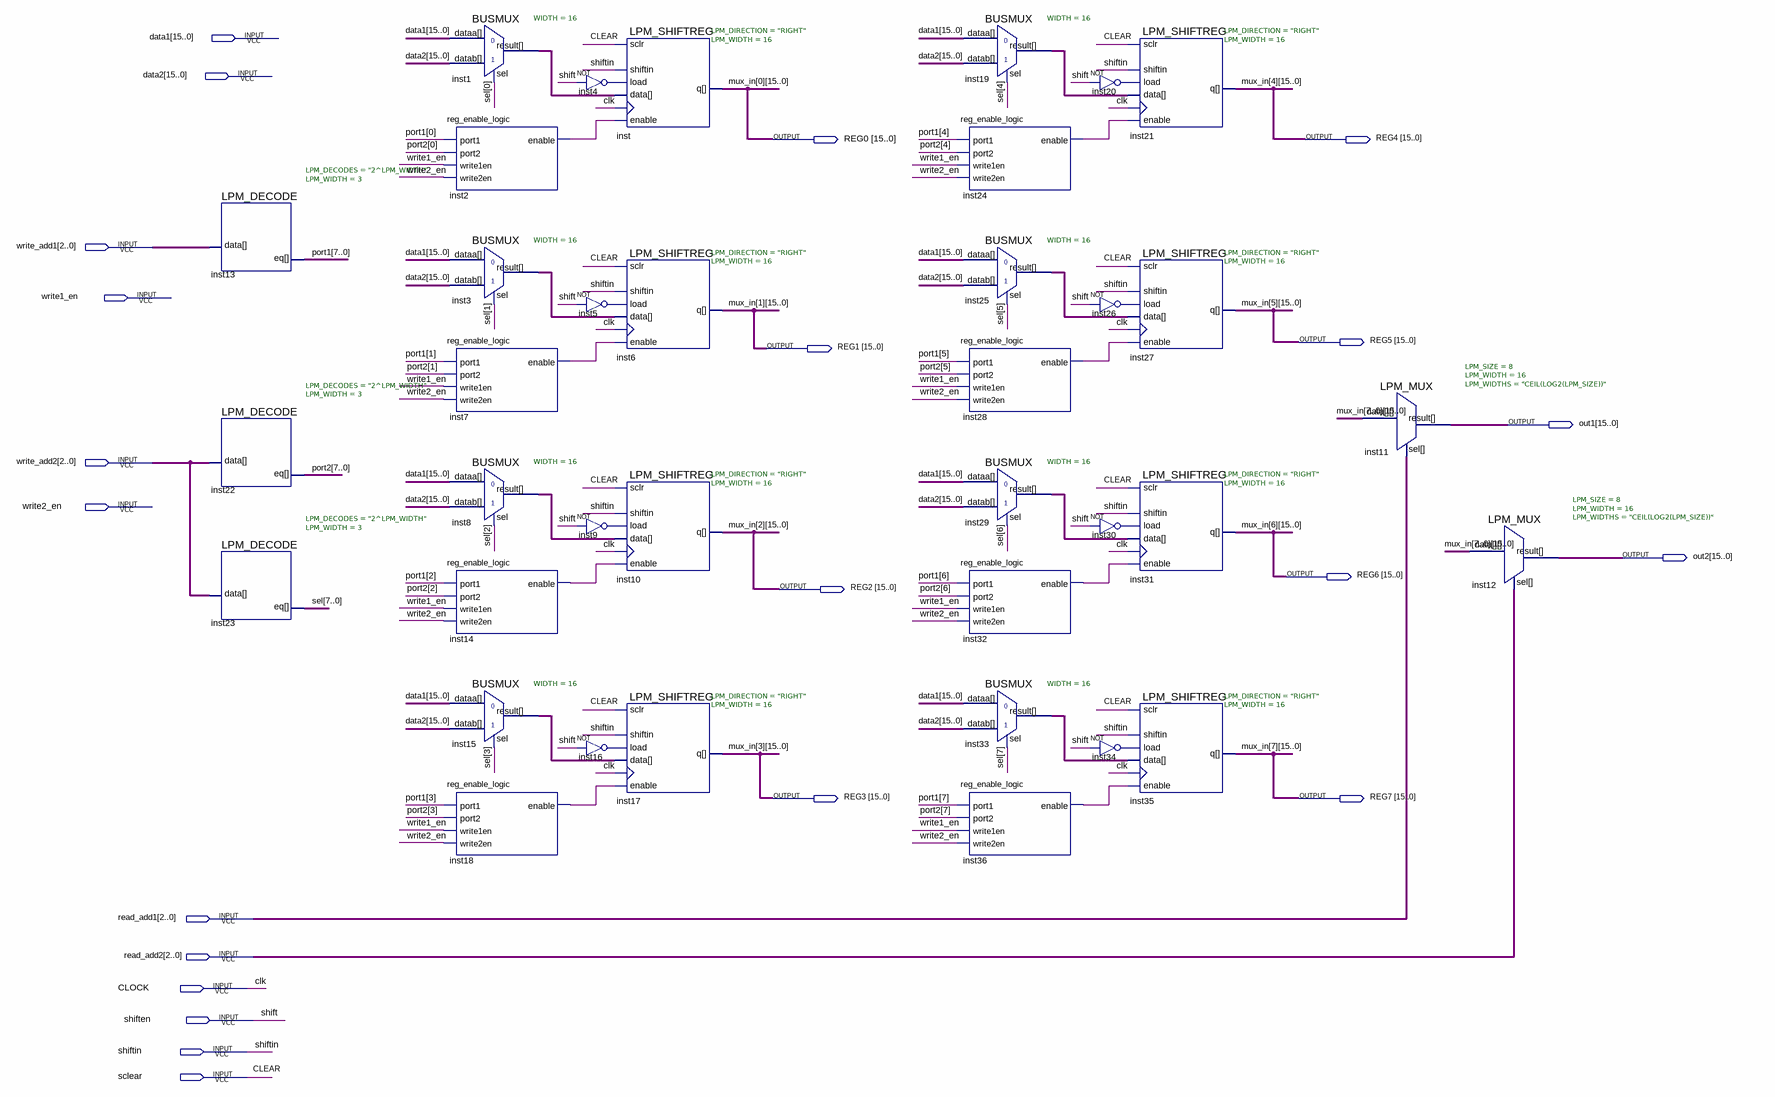
[diagram p0: schematic sheet]
// Quartus schematic register_file.bdf as structural Verilog: 37 symbols, 22 pins
module register_file (
  input  [15:0] data1,
  input  [15:0] data2,
  input  [2:0] write_add1,
  input  write1_en,
  input  [2:0] write_add2,
  input  write2_en,
  input  [2:0] read_add1,
  input  [2:0] read_add2,
  input  CLOCK,
  input  shiften,
  input  shiftin,
  input  sclear,
  output [15:0] REG0,
  output [15:0] REG4,
  output [15:0] REG5,
  output [15:0] REG1,
  output [15:0] out1,
  output [15:0] out2,
  output [15:0] REG6,
  output [15:0] REG2,
  output [15:0] REG3,
  output [15:0] REG7
);

  wire inst2_enable, inst4_out, inst5_out, inst7_enable, inst9_out, inst14_enable, inst16_out, inst18_enable,
       inst20_out, inst24_enable, inst26_out, inst28_enable, inst30_out, inst32_enable, inst34_out,
       inst36_enable;
  wire [7:0] port1, port2, sel;
  wire [15:0] inst1_result, inst3_result, inst8_result, inst15_result, inst19_result, inst25_result,
       inst29_result, inst33_result;

  LPM_DECODE #(.LPM_DECODES("2^LPM_WIDTH"), .LPM_WIDTH(3)) inst13 (.data(write_add1), .eq(port1));
  LPM_DECODE #(.LPM_DECODES("2^LPM_WIDTH"), .LPM_WIDTH(3)) inst22 (.data(write_add2), .eq(port2));
  LPM_DECODE #(.LPM_DECODES("2^LPM_WIDTH"), .LPM_WIDTH(3)) inst23 (.data(write_add2), .eq(sel));
  reg_enable_logic inst2 (
    .port1(port1[0]), .port2(port2[0]), .write1en(write1_en), .write2en(write2_en), .enable(inst2_enable));
  reg_enable_logic inst7 (
    .port1(port1[1]), .port2(port2[1]), .write1en(write1_en), .write2en(write2_en), .enable(inst7_enable));
  reg_enable_logic inst14 (
    .port1(port1[2]), .port2(port2[2]), .write1en(write1_en), .write2en(write2_en), .enable(inst14_enable));
  reg_enable_logic inst18 (
    .port1(port1[3]), .port2(port2[3]), .write1en(write1_en), .write2en(write2_en), .enable(inst18_enable));
  BUSMUX #(.WIDTH(16)) inst1 (.datab(data2), .sel(sel[0]), .dataa(data1), .result(inst1_result));
  BUSMUX #(.WIDTH(16)) inst3 (.datab(data2), .sel(sel[1]), .dataa(data1), .result(inst3_result));
  BUSMUX #(.WIDTH(16)) inst8 (.datab(data2), .sel(sel[2]), .dataa(data1), .result(inst8_result));
  BUSMUX #(.WIDTH(16)) inst15 (.datab(data2), .sel(sel[3]), .dataa(data1), .result(inst15_result));
  not inst4 (inst4_out, shiften);
  not inst5 (inst5_out, shiften);
  not inst9 (inst9_out, shiften);
  not inst16 (inst16_out, shiften);
  LPM_SHIFTREG #(.LPM_DIRECTION("RIGHT"), .LPM_WIDTH(16)) inst (
    .clock(CLOCK), .data(inst1_result), .enable(inst2_enable), .load(inst4_out), .sclr(sclear),
    .shiftin(shiftin), .q(REG0));
  LPM_SHIFTREG #(.LPM_DIRECTION("RIGHT"), .LPM_WIDTH(16)) inst6 (
    .clock(CLOCK), .data(inst3_result), .enable(inst7_enable), .load(inst5_out), .sclr(sclear),
    .shiftin(shiftin), .q(REG1));
  LPM_SHIFTREG #(.LPM_DIRECTION("RIGHT"), .LPM_WIDTH(16)) inst10 (
    .clock(CLOCK), .data(inst8_result), .enable(inst14_enable), .load(inst9_out), .sclr(sclear),
    .shiftin(shiftin), .q(REG2));
  LPM_SHIFTREG #(.LPM_DIRECTION("RIGHT"), .LPM_WIDTH(16)) inst17 (
    .clock(CLOCK), .data(inst15_result), .enable(inst18_enable), .load(inst16_out), .sclr(sclear),
    .shiftin(shiftin), .q(REG3));
  BUSMUX #(.WIDTH(16)) inst19 (.datab(data2), .sel(sel[4]), .dataa(data1), .result(inst19_result));
  reg_enable_logic inst24 (
    .port1(port1[4]), .port2(port2[4]), .write1en(write1_en), .write2en(write2_en), .enable(inst24_enable));
  BUSMUX #(.WIDTH(16)) inst25 (.datab(data2), .sel(sel[5]), .dataa(data1), .result(inst25_result));
  reg_enable_logic inst28 (
    .port1(port1[5]), .port2(port2[5]), .write1en(write1_en), .write2en(write2_en), .enable(inst28_enable));
  BUSMUX #(.WIDTH(16)) inst29 (.datab(data2), .sel(sel[6]), .dataa(data1), .result(inst29_result));
  reg_enable_logic inst32 (
    .port1(port1[6]), .port2(port2[6]), .write1en(write1_en), .write2en(write2_en), .enable(inst32_enable));
  BUSMUX #(.WIDTH(16)) inst33 (.datab(data2), .sel(sel[7]), .dataa(data1), .result(inst33_result));
  reg_enable_logic inst36 (
    .port1(port1[7]), .port2(port2[7]), .write1en(write1_en), .write2en(write2_en), .enable(inst36_enable));
  not inst20 (inst20_out, shiften);
  not inst26 (inst26_out, shiften);
  not inst30 (inst30_out, shiften);
  not inst34 (inst34_out, shiften);
  LPM_SHIFTREG #(.LPM_DIRECTION("RIGHT"), .LPM_WIDTH(16)) inst21 (
    .clock(CLOCK), .data(inst19_result), .enable(inst24_enable), .load(inst20_out), .sclr(sclear),
    .shiftin(shiftin), .q(REG4));
  LPM_SHIFTREG #(.LPM_DIRECTION("RIGHT"), .LPM_WIDTH(16)) inst27 (
    .clock(CLOCK), .data(inst25_result), .enable(inst28_enable), .load(inst26_out), .sclr(sclear),
    .shiftin(shiftin), .q(REG5));
  LPM_SHIFTREG #(.LPM_DIRECTION("RIGHT"), .LPM_WIDTH(16)) inst31 (
    .clock(CLOCK), .data(inst29_result), .enable(inst32_enable), .load(inst30_out), .sclr(sclear),
    .shiftin(shiftin), .q(REG6));
  LPM_SHIFTREG #(.LPM_DIRECTION("RIGHT"), .LPM_WIDTH(16)) inst35 (
    .clock(CLOCK), .data(inst33_result), .enable(inst36_enable), .load(inst34_out), .sclr(sclear),
    .shiftin(shiftin), .q(REG7));
  LPM_MUX #(.LPM_SIZE(8), .LPM_WIDTH(16), .LPM_WIDTHS("CEIL(LOG2(LPM_SIZE))")) inst11 (
    .data({REG7, REG6, REG5, REG4, REG3, REG2, REG1, REG0}), .sel(read_add1), .result(out1));
  LPM_MUX #(.LPM_SIZE(8), .LPM_WIDTH(16), .LPM_WIDTHS("CEIL(LOG2(LPM_SIZE))")) inst12 (
    .data({REG7, REG6, REG5, REG4, REG3, REG2, REG1, REG0}), .sel(read_add2), .result(out2));

  // Other names for the same wires on the sheet: CLEAR = sclear; clk = CLOCK; mux_in_3[15:0] = REG3;
  //   mux_in_4[15:0] = REG4; mux_in_5[15:0] = REG5; mux_in_6[15:0] = REG6; mux_in_7[15:0] = REG7;
  //   mux_in_0[15:0] = REG0; mux_in_1[15:0] = REG1; mux_in_2[15:0] = REG2; shift = shiften
endmodule
